# EAGLE design edison_mezzanine_9dof (EAGLE 6.6.0)

## Sheet 1 of 2
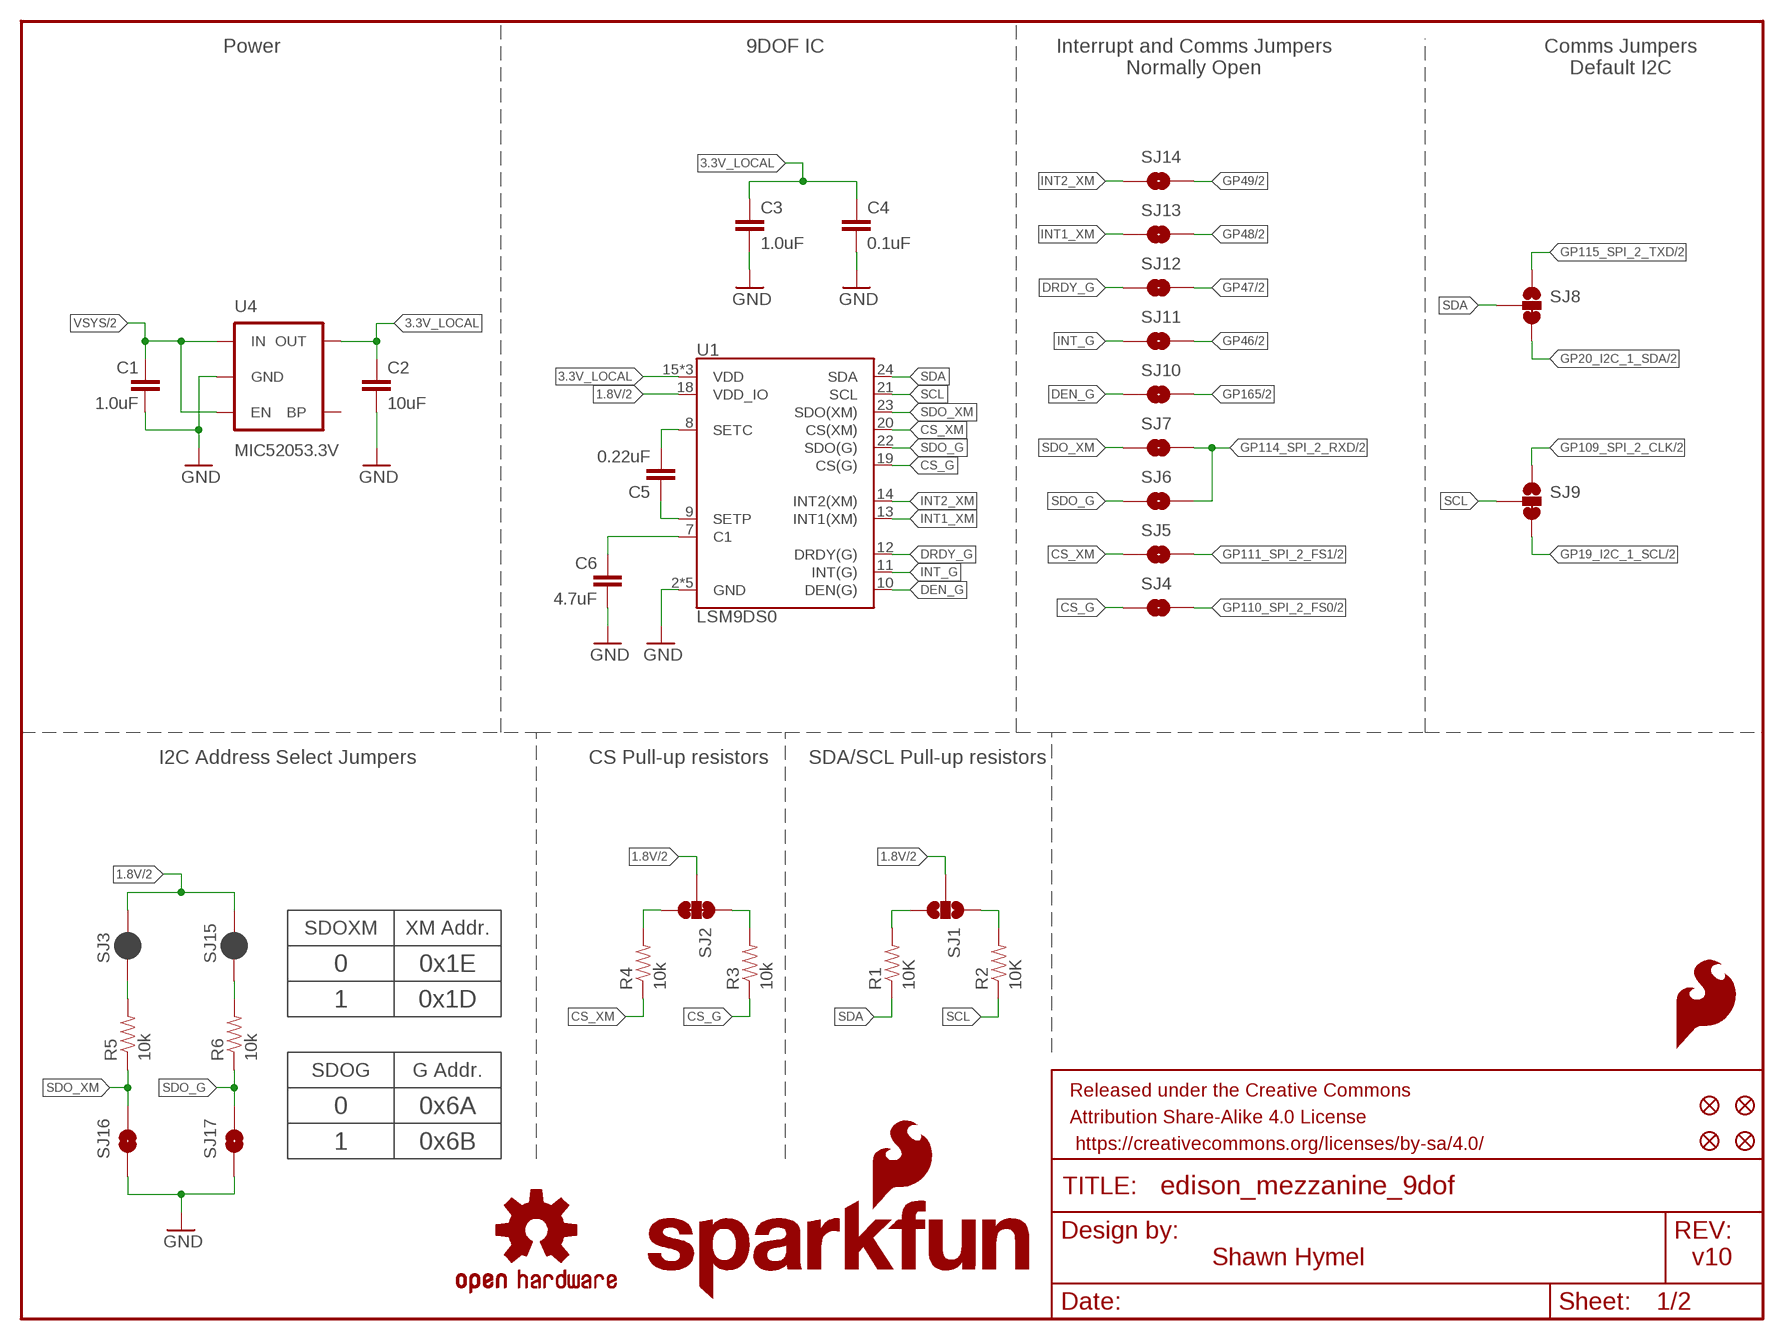
[diagram p0: schematic, sheet 1]

### Parts
C1  1.0uF  1.0UF-16V-10%(0603)  [0603-CAP]
C2  10uF  CAP0805  [0805]
C3  1.0uF  1.0UF-16V-10%(0603)  [0603-CAP]
C4  0.1uF  0.1UF-25V(+80/-20%)(0603)  [0603-CAP]
C5  0.22uF  0.22UF-25V-10%(0603)  [0603-CAP]
C6  4.7uF  4.7UF-6.3V-10%(0603)0603  [0603-CAP]
FID1  FIDUCIAL1X2  [FIDUCIAL-1X2]
FID2  FIDUCIAL1X2  [FIDUCIAL-1X2]
FID3  FIDUCIAL1X2  [FIDUCIAL-1X2]
FID4  FIDUCIAL1X2  [FIDUCIAL-1X2]
FRAME1  FRAME-LETTER  [CREATIVE_COMMONS]
LOGO1  SFE_LOGO_FLAME.2_INCH  [SFE_LOGO_FLAME_.2]
LOGO2  OSHW-LOGOS  [OSHW-LOGO-S]
LOGO3  SFE_LOGO_NAME_FLAME.1_INCH  [SFE_LOGO_NAME_FLAME_.1]
R1  10K  10KOHM1/10W1%(0603)0603  [0603-RES]
R2  10K  10KOHM1/10W1%(0603)0603  [0603-RES]
R3  10k  10K-1%RES-00824  [0603-RES]
R4  10k  10K-1%RES-00824  [0603-RES]
R5  10k  10K-1%RES-00824  [0603-RES]
R6  10k  10K-1%RES-00824  [0603-RES]
SJ1  JUMPER-PAD-3-NOYES_SILK  [PAD-JUMPER-3-NO_YES_SILK]
SJ2  JUMPER-PAD-3-NC_BY_TRACE  [PAD-JUMPER-3-3OF3_NC_BY_TRACE_YES_SILK_FULL_BOX]
SJ3  JUMPER-PAD-2-NC_BY_PASTE  [PAD-JUMPER-2-NC_BY_PASTE_YES_SILK]
SJ4  JUMPER-PAD-2-NOYES_SILK  [PAD-JUMPER-2-NO_YES_SILK]
SJ5  JUMPER-PAD-2-NOYES_SILK  [PAD-JUMPER-2-NO_YES_SILK]
SJ6  JUMPER-PAD-2-NOYES_SILK  [PAD-JUMPER-2-NO_YES_SILK]
SJ7  JUMPER-PAD-2-NOYES_SILK  [PAD-JUMPER-2-NO_YES_SILK]
SJ8  JUMPER-PAD-3-2OF3_NC_BY_TRACE_SMALL  [PAD-JUMPER-3-2OF3_NC_BY_TRACE_YES_SILK_FULL_BOX]
SJ9  JUMPER-PAD-3-2OF3_NC_BY_TRACE_SMALL  [PAD-JUMPER-3-2OF3_NC_BY_TRACE_YES_SILK_FULL_BOX]
SJ10  JUMPER-PAD-2-NOYES_SILK  [PAD-JUMPER-2-NO_YES_SILK]
SJ11  JUMPER-PAD-2-NOYES_SILK  [PAD-JUMPER-2-NO_YES_SILK]
SJ12  JUMPER-PAD-2-NOYES_SILK  [PAD-JUMPER-2-NO_YES_SILK]
SJ13  JUMPER-PAD-2-NOYES_SILK  [PAD-JUMPER-2-NO_YES_SILK]
SJ14  JUMPER-PAD-2-NOYES_SILK  [PAD-JUMPER-2-NO_YES_SILK]
SJ15  JUMPER-PAD-2-NC_BY_PASTE  [PAD-JUMPER-2-NC_BY_PASTE_YES_SILK]
SJ16  JUMPER-PAD-2-NOYES_SILK  [PAD-JUMPER-2-NO_YES_SILK]
SJ17  JUMPER-PAD-2-NOYES_SILK  [PAD-JUMPER-2-NO_YES_SILK]
U1  LSM9DS0  [LGA-24]
U4  MIC52053.3V  [SOT23-5]

### Nets
1.8V: SJ1.2 SJ2.2 SJ3.2 SJ15.2 U1.18(VDD_IO) ; also sheet 2
3.3V_LOCAL: C2.1 C3.1 C4.1 U1.15(VDD) U1.16(VDD) U1.17(VDD) U4.5(OUT)
CS_G: R3.1 SJ4.1 U1.19(CS(G))
CS_XM: R4.1 SJ5.1 U1.20(CS(XM))
DEN_G: SJ10.1 U1.10(DEN(G))
DRDY_G: SJ12.1 U1.12(DRDY(G))
GND: C1.2 C2.2 C3.2 C4.2 C6.2 SJ16.1 SJ17.1 U1.2(GND) U1.3(GND) U1.4(GND) U1.5(GND) U1.6(GND) U4.2(GND) ; also sheet 2
GP19_I2C_1_SCL: SJ9.3 ; also sheet 2
GP20_I2C_1_SDA: SJ8.3 ; also sheet 2
GP46: SJ11.2 ; also sheet 2
GP47: SJ12.2 ; also sheet 2
GP48: SJ13.2 ; also sheet 2
GP49: SJ14.2 ; also sheet 2
GP109_SPI_2_CLK: SJ9.1 ; also sheet 2
GP110_SPI_2_FS0: SJ4.2 ; also sheet 2
GP111_SPI_2_FS1: SJ5.2 ; also sheet 2
GP114_SPI_2_RXD: SJ6.2 SJ7.2 ; also sheet 2
GP115_SPI_2_TXD: SJ8.1 ; also sheet 2
GP165: SJ10.2 ; also sheet 2
INT1_XM: SJ13.1 U1.13(INT1(XM))
INT2_XM: SJ14.1 U1.14(INT2(XM))
INT_G: SJ11.1 U1.11(INT(G))
N$1: C5.1 U1.9(SETP)
N$2: C5.2 U1.8(SETC)
N$3: C6.1 U1.7(C1)
N$4: R3.2 SJ2.1
N$5: R4.2 SJ2.3
N$6: R1.2 SJ1.3
N$7: R2.2 SJ1.1
N$12: R5.2 SJ3.1
N$13: R6.2 SJ15.1
SCL: R2.1 SJ9.2 U1.21(SCL)
SDA: R1.1 SJ8.2 U1.24(SDA)
SDO_G: R6.1 SJ6.1 SJ17.2 U1.22(SDO(G))
SDO_XM: R5.1 SJ7.1 SJ16.2 U1.23(SDO(XM))
VSYS: C1.1 U4.1(IN) U4.3(EN) ; also sheet 2
Unconnected: U4.4(BP)

### Notes on the sheet
- Power | 9DOF IC
- Interrupt and Comms Jumpers
  Normally Open
- Comms Jumpers
  Default I2C
- I2C Address Select Jumpers | CS Pull-up resistors | SDA/SCL Pull-up resistors
- SDOXM | XM Addr.
- 0 | 0x1E
- 1 | 0x1D
- SDOG | G Addr.
- 0 | 0x6A
- 1 | 0x6B
- Shawn Hymel | v10

## Sheet 2 of 2
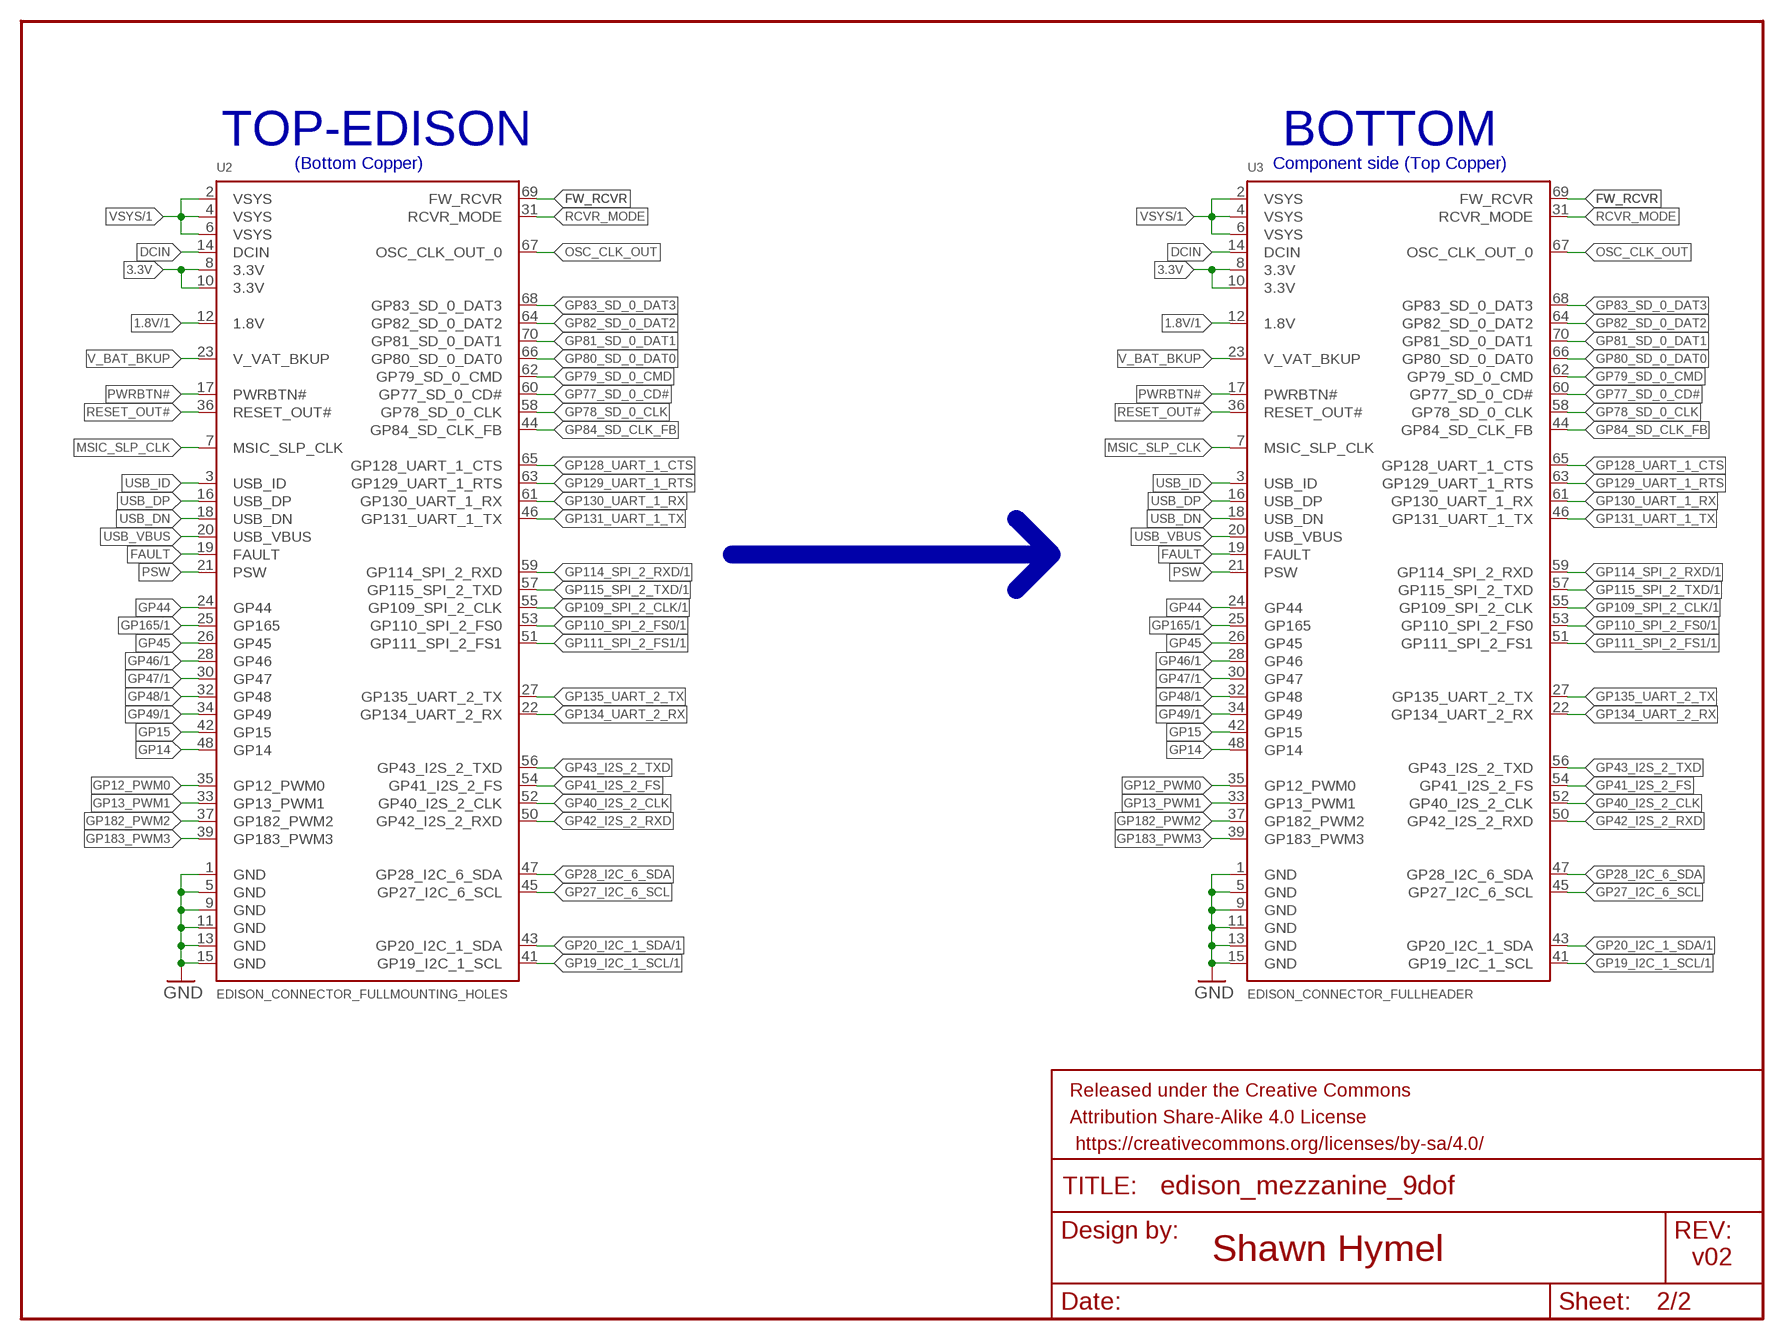
[diagram p1: schematic, sheet 2]

### Parts
FRAME2  FRAME-LETTER  [CREATIVE_COMMONS]
U2  EDISON_CONNECTOR_FULLMOUNTING_HOLES  [EDISON_DAUGHTER]
U3  EDISON_CONNECTOR_FULLHEADER  [DF40C-70DP-0.4(51)]

### Nets
1.8V: U2.12(1.8V) U3.12(1.8V) ; also sheet 1
3.3V: U2.8(3.3V) U2.10(3.3V) U3.8(3.3V) U3.10(3.3V)
DCIN: U2.14(DCIN) U3.14(DCIN)
FAULT: U2.19(FAULT) U3.19(FAULT)
FW_RCVR: U2.69(FW_RCVR) U3.69(FW_RCVR)
GND: U2.1(GND) U2.5(GND) U2.9(GND) U2.11(GND) U2.13(GND) U2.15(GND) U3.1(GND) U3.5(GND) U3.9(GND) U3.11(GND) U3.13(GND) U3.15(GND) ; also sheet 1
GP12_PWM0: U2.35(GP12_PWM0) U3.35(GP12_PWM0)
GP13_PWM1: U2.33(GP13_PWM1) U3.33(GP13_PWM1)
GP14: U2.48(GP14) U3.48(GP14)
GP15: U2.42(GP15) U3.42(GP15)
GP19_I2C_1_SCL: U2.41(GP19_I2C_1_SCL) U3.41(GP19_I2C_1_SCL) ; also sheet 1
GP20_I2C_1_SDA: U2.43(GP20_I2C_1_SDA) U3.43(GP20_I2C_1_SDA) ; also sheet 1
GP27_I2C_6_SCL: U2.45(GP27_I2C_6_SCL) U3.45(GP27_I2C_6_SCL)
GP28_I2C_6_SDA: U2.47(GP28_I2C_6_SDA) U3.47(GP28_I2C_6_SDA)
GP40_I2S_2_CLK: U2.52(GP40_I2S_2_CLK) U3.52(GP40_I2S_2_CLK)
GP41_I2S_2_FS: U2.54(GP41_I2S_2_FS) U3.54(GP41_I2S_2_FS)
GP42_I2S_2_RXD: U2.50(GP42_I2S_2_RXD) U3.50(GP42_I2S_2_RXD)
GP43_I2S_2_TXD: U2.56(GP43_I2S_2_TXD) U3.56(GP43_I2S_2_TXD)
GP44: U2.24(GP44) U3.24(GP44)
GP45: U2.26(GP45) U3.26(GP45)
GP46: U2.28(GP46) U3.28(GP46) ; also sheet 1
GP47: U2.30(GP47) U3.30(GP47) ; also sheet 1
GP48: U2.32(GP48) U3.32(GP48) ; also sheet 1
GP49: U2.34(GP49) U3.34(GP49) ; also sheet 1
GP77_SD_0_CD#: U2.60(GP77_SD_0_CD#) U3.60(GP77_SD_0_CD#)
GP78_SD_0_CLK: U2.58(GP78_SD_0_CLK) U3.58(GP78_SD_0_CLK)
GP79_SD_0_CMD: U2.62(GP79_SD_0_CMD) U3.62(GP79_SD_0_CMD)
GP80_SD_0_DAT0: U2.66(GP80_SD_0_DAT0) U3.66(GP80_SD_0_DAT0)
GP81_SD_0_DAT1: U2.70(GP81_SD_0_DAT1) U3.70(GP81_SD_0_DAT1)
GP82_SD_0_DAT2: U2.64(GP82_SD_0_DAT2) U3.64(GP82_SD_0_DAT2)
GP83_SD_0_DAT3: U2.68(GP83_SD_0_DAT3) U3.68(GP83_SD_0_DAT3)
GP84_SD_CLK_FB: U2.44(GP84_SD_CLK_FB) U3.44(GP84_SD_CLK_FB)
GP109_SPI_2_CLK: U2.55(GP109_SPI_2_CLK) U3.55(GP109_SPI_2_CLK) ; also sheet 1
GP110_SPI_2_FS0: U2.53(GP110_SPI_2_FS0) U3.53(GP110_SPI_2_FS0) ; also sheet 1
GP111_SPI_2_FS1: U2.51(GP111_SPI_2_FS1) U3.51(GP111_SPI_2_FS1) ; also sheet 1
GP114_SPI_2_RXD: U2.59(GP114_SPI_2_RXD) U3.59(GP114_SPI_2_RXD) ; also sheet 1
GP115_SPI_2_TXD: U2.57(GP115_SPI_2_TXD) U3.57(GP115_SPI_2_TXD) ; also sheet 1
GP128_UART_1_CTS: U2.65(GP128_UART_1_CTS) U3.65(GP128_UART_1_CTS)
GP129_UART_1_RTS: U2.63(GP129_UART_1_RTS) U3.63(GP129_UART_1_RTS)
GP130_UART_1_RX: U2.61(GP130_UART_1_RX) U3.61(GP130_UART_1_RX)
GP131_UART_1_TX: U2.46(GP131_UART_1_TX) U3.46(GP131_UART_1_TX)
GP134_UART_2_RX: U2.22(GP134_UART_2_RX) U3.22(GP134_UART_2_RX)
GP135_UART_2_TX: U2.27(GP135_UART_2_TX) U3.27(GP135_UART_2_TX)
GP165: U2.25(GP165) U3.25(GP165) ; also sheet 1
GP182_PWM2: U2.37(GP182_PWM2) U3.37(GP182_PWM2)
GP183_PWM3: U2.39(GP183_PWM3) U3.39(GP183_PWM3)
MSIC_SLP_CLK: U2.7(MSIC_SLP_CLK) U3.7(MSIC_SLP_CLK)
OSC_CLK_OUT: U2.67(OSC_CLK_OUT_0) U3.67(OSC_CLK_OUT_0)
PSW: U2.21(PSW) U3.21(PSW)
PWRBTN#: U2.17(PWRBTN#) U3.17(PWRBTN#)
RCVR_MODE: U2.31(RCVR_MODE) U3.31(RCVR_MODE)
RESET_OUT#: U2.36(RESET_OUT#) U3.36(RESET_OUT#)
USB_DN: U2.18(USB_DN) U3.18(USB_DN)
USB_DP: U2.16(USB_DP) U3.16(USB_DP)
USB_ID: U2.3(USB_ID) U3.3(USB_ID)
USB_VBUS: U2.20(USB_VBUS) U3.20(USB_VBUS)
V_BAT_BKUP: U2.23(V_VAT_BKUP) U3.23(V_VAT_BKUP)
VSYS: U2.2(VSYS) U2.4(VSYS) U2.6(VSYS) U3.2(VSYS) U3.4(VSYS) U3.6(VSYS) ; also sheet 1

### Buses
B$1

### Notes on the sheet
- TOP-EDISON | BOTTOM
- (Bottom Copper) | Component side (Top Copper)
- Shawn Hymel
- v02

## Library data of the parts
C1 C3 = SparkFun-Capacitors:1.0UF-16V-10%(0603): CAP-00868; PROD_ID: CAP-00868
C2 = SparkFun-Capacitors:CAP: Capacitor Standard 0603 ceramic capacitor, and 0.1" leaded capacitor.; PROD_ID: CAP-11330
C4 = SparkFun-Capacitors:0.1UF-25V(+80/-20%)(0603): CAP-00810 Ceramic Standard decoupling cap; PROD_ID: CAP-00810
C5 = SparkFun-Capacitors:0.22UF-25V-10%(0603): CAP-07822; PROD_ID: CAP-07822
C6 = SparkFun-Capacitors:4.7UF-6.3V-10%(0603): CAP-08280; PROD_ID: CAP-08280
FID1-FID4 = SparkFun-Aesthetics:FIDUCIAL: Fiducial Alignment Points Various fiducial points for machine vision alignment.
FRAME1 FRAME2 = SparkFun-Aesthetics:FRAME-LETTER: Schematic Frame Standard 8.5x11 US Letter frame
LOGO1 = SparkFun-Aesthetics:SFE_LOGO_FLAME: SFE Logo, flame only This is the SparkFun flame logo. The logo on the schematic will always be the same size; the package variant is the height of the flame. Default layer for the logo on the board is tSilk.
LOGO2 = SparkFun-Aesthetics:OSHW-LOGO: Open Source Hardware Logo This logo indicates the piece of hardware it is found on incorporates a OSHW license and/or adheres to the definition of open source hardware found here: http://freedomdefined.org/OSHW
LOGO3 = SparkFun-Aesthetics:SFE_LOGO_NAME_FLAME: SFE Logo, name and flame This is the SparkFun full logo. The logo on the schematic will always be the same size; the package variant is the height of the flame part of the logo. Default layer for the logo on the board is tSilk.
R1 R2 = SparkFun-Resistors:10KOHM1/10W1%(0603): RES-00824; PROD_ID: RES-00824
R3-R6 = SparkFun-Resistors:10K-1%: 10k-ohm SMT 1/10W - 1% (0603) RES-00824; PROD_ID: RES-00824
SJ1 = SparkFun-Passives:JUMPER-PAD-3-NO
SJ2 = SparkFun-Passives:JUMPER-PAD-3-NC_BY_TRACE
SJ3 SJ15 = SparkFun-Passives:JUMPER-PAD-2-NC_BY_PASTE
SJ4-SJ7 SJ10-SJ14 SJ16 SJ17 = SparkFun-Passives:JUMPER-PAD-2-NO
SJ8 SJ9 = SparkFun-Passives:JUMPER-PAD-3-2OF3_NC_BY_TRACE
U1 = SparkFun-DigitalIC:LSM9DS0: LSM9DS0 3D Accelerometer, 3D Gyroscope, 3D Magnetomter Features: 3 acceleration channels, 3 angular rate channels, 3 magnetic field channels ±2/±4/±6/±8/±16 g linear acceleration full scale ±2/±4/±8/±12 gauss magnetic full scale ±245/±500/±2000 dps angular rate full scale 16-bit data output SPI / I2C serial interfaces Analog supply voltage 2.4 V to 3.6 V Power-down mode / low-power mode Programmable interrupt generators Embedded self-test Embedded temperature sensor Embedded FIFO Position and motion detection functions Click/double-click recognition
U2 U3 = Edison:EDISON_CONNECTOR_FULL
U4 = SparkFun-PowerIC:MIC5205: MIC5205 150mA vreg 3.3V - VREG-00822 5V - VREG-00823; PROD_ID: VREG-00822

## Board
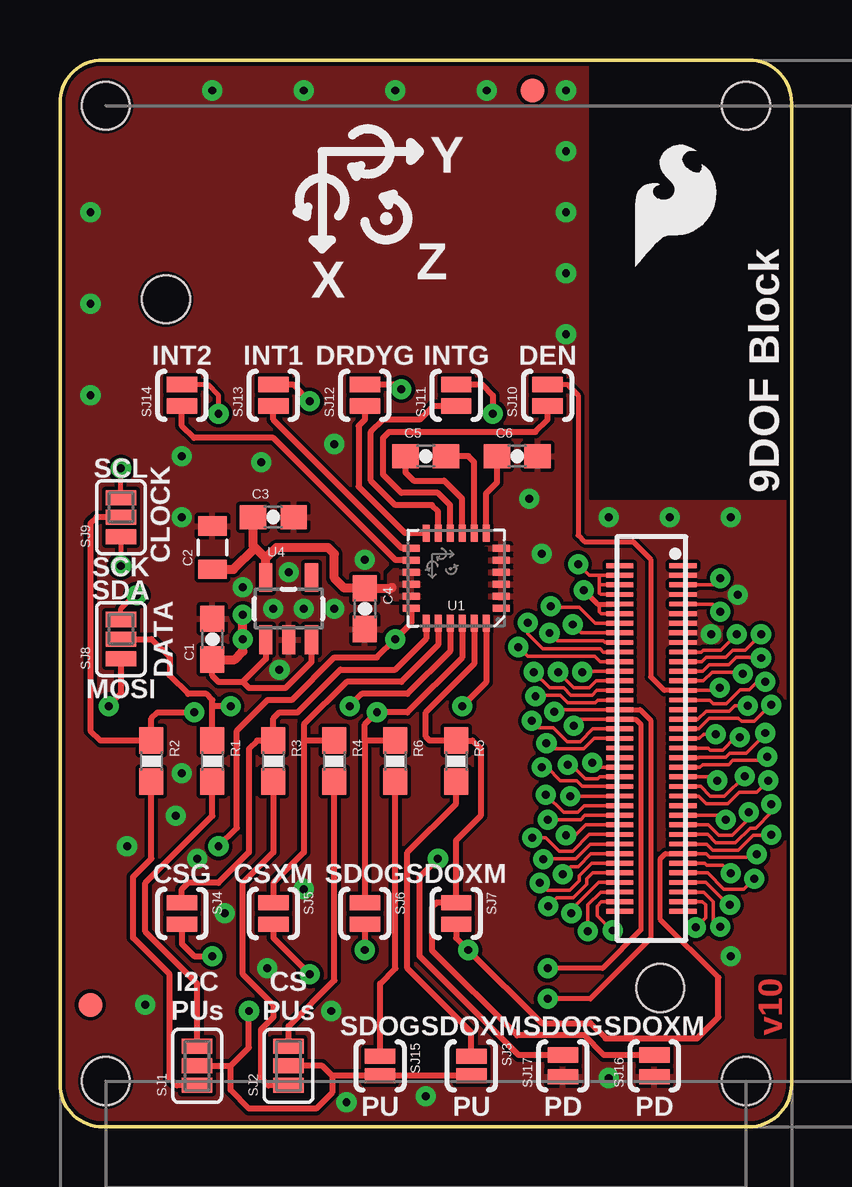
[diagram p2: board, top side]
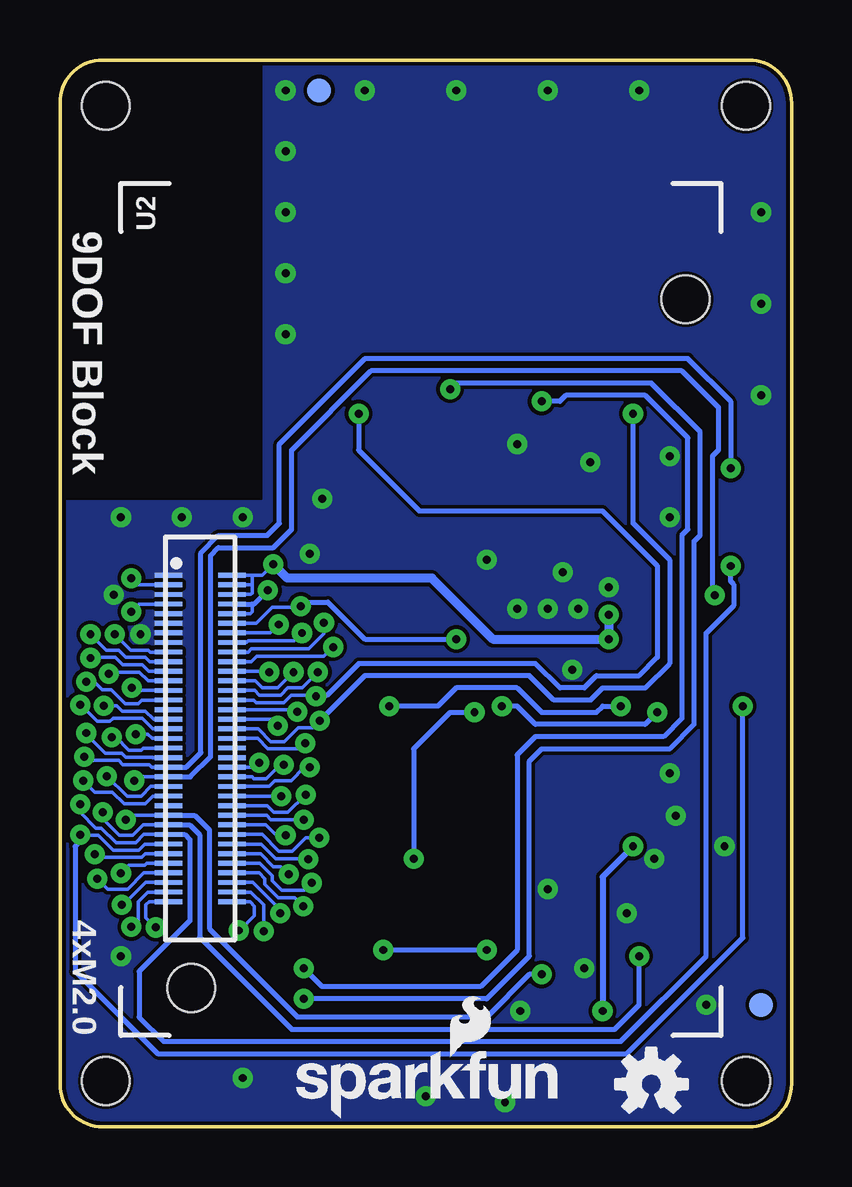
[diagram p3: board, bottom side, seen from below]

Size 30.48 x 44.45 mm. Coordinates in mm from the lower left corner, seen from the top.
Outline: 30.48,42.67 30.48,1.78 arc-90 28.7,0 1.78,0 arc-90 0,1.78 0,42.67 arc-90 1.78,44.45 28.7,44.45 arc-90 30.48,42.67
Copper layers (1*16): Top 0.035mm / dielectric 1.5mm / Bottom 0.035mm
Design rules "SparkFun-2-layer *": minimum track width 6mil, minimum drill 13mil, track to track 6mil, track to pad 6mil, pad to pad 6mil, via to via 6mil, smd to smd 6mil, copper to edge 6mil, drill to drill 6mil, minimum pad ring 12mil, minimum via ring 10mil, stop-mask expansion 4mil, vias tented up to drill 20mil, thermal gap 6mil
Holes 2 mm at 28.57,1.91 1.91,1.91 1.91,42.55 28.57,42.55
tRestrict: area 22.1,26.2 to 30.5,44.5; area 15.2,21.6 to 17.8,24.1
bRestrict: area 22.1,26.2 to 30.5,44.5

### Footprints (pad centres in the part's own frame; a part is rotated, then mirrored left to right if it is on the bottom)
0603-CAP = smd 1.1 x 1: 1 -0.85,0; 2 0.85,0
0805 = smd 0.8 x 1.2: 1 -0.9,0; 2 0.9,0
FIDUCIAL-1X2 = smd 1 x 1: 1 0,0
0603-RES = smd 1.1 x 1: 1 -0.85,0; 2 0.85,0
PAD-JUMPER-3-NC_BY_PASTE_YES_SILK_FULL_BOX = smd 0.635 x 1.27: 1 -0.813,0; 2 0,0; 3 0.813,0
PAD-JUMPER-2-NC_BY_PASTE_YES_SILK = smd 0.635 x 1.27: 1 -0.401,0; 2 0.413,0
PAD-JUMPER-2-NO_YES_SILK = smd 0.635 x 1.27: 1 -0.45,0; 2 0.45,0
PAD-JUMPER-3-2OF3_NC_BY_PASTE_YES_SILK_FULL_BOX = smd 0.635 x 1.27: 1 -0.813,0; 2 0,0; 3 0.813,0
LGA-24 = smd 0.7 x 0.29: 1 -1.875,1.25; 2 -1.875,0.75; 3 -1.875,0.25; 4 -1.875,-0.25; 5 -1.875,-0.75; 6 -1.875,-1.25; 13 1.875,-1.25; 14 1.875,-0.75; 15 1.875,-0.25; 16 1.875,0.25; 17 1.875,0.75; 18 1.875,1.25 | smd 0.29 x 0.7: 7 -1.25,-1.875; 8 -0.75,-1.875; 9 -0.25,-1.875; 10 0.25,-1.875; 11 0.75,-1.875; 12 1.25,-1.875; 19 1.25,1.875; 20 0.75,1.875; 21 0.25,1.875; 22 -0.25,1.875; 23 -0.75,1.875; 24 -1.25,1.875
EDISON_DAUGHTER = smd 1.14 x 0.2: 1 1.98,19.17; 2 4.62,19.17; 3 1.98,18.77; 4 4.62,18.77; 5 1.98,18.37; 6 4.62,18.37; 7 1.98,17.97; 8 4.62,17.97; 9 1.98,17.57; 10 4.62,17.57; 11 1.98,17.17; 12 4.62,17.17; 13 1.98,16.77; 14 4.62,16.77; 15 1.98,16.37; 16 4.62,16.37; 17 1.98,15.97; 18 4.62,15.97; 19 1.98,15.57; 20 4.62,15.57; 21 1.98,15.17; 22 4.62,15.17; 23 1.98,14.77; 24 4.62,14.77; 25 1.98,14.37; 26 4.62,14.37; 27 1.98,13.97; 28 4.62,13.97; 29 1.98,13.57; 30 4.62,13.57; 31 1.98,13.17; 32 4.62,13.17; 33 1.98,12.77; 34 4.62,12.77; 35 1.98,12.37; 36 4.62,12.37; 37 1.98,11.97; 38 4.62,11.97; 39 1.98,11.57; 40 4.62,11.57; 41 1.98,11.17; 42 4.62,11.17; 43 1.98,10.77; 44 4.62,10.77; 45 1.98,10.37; 46 4.62,10.37; 47 1.98,9.97; 48 4.62,9.97; 49 1.98,9.57; 50 4.62,9.57; 51 1.98,9.17; 52 4.62,9.17; 53 1.98,8.77; 54 4.62,8.77; 55 1.98,8.37; 56 4.62,8.37; 57 1.98,7.97; 58 4.62,7.97; 59 1.98,7.57; 60 4.62,7.57; 61 1.98,7.17; 62 4.62,7.17; 63 1.98,6.77; 64 4.62,6.77; 65 1.98,6.37; 66 4.62,6.37; 67 1.98,5.97; 68 4.62,5.97; 69 1.98,5.57; 70 4.62,5.57 | hole 2: 23.53,30.67; 2.93,1.98
DF40C-70DP-0.4(51) = smd 0.2 x 1.14 bottom: 1 6.8,1.32; 2 6.8,-1.32; 3 6.4,1.32; 4 6.4,-1.32; 5 6,1.32; 6 6,-1.32; 7 5.6,1.32; 8 5.6,-1.32; 9 5.2,1.32; 10 5.2,-1.32; 11 4.8,1.32; 12 4.8,-1.32; 13 4.4,1.32; 14 4.4,-1.32; 15 4,1.32; 16 4,-1.32; 17 3.6,1.32; 18 3.6,-1.32; 19 3.2,1.32; 20 3.2,-1.32; 21 2.8,1.32; 22 2.8,-1.32; 23 2.4,1.32; 24 2.4,-1.32; 25 2,1.32; 26 2,-1.32; 27 1.6,1.32; 28 1.6,-1.32; 29 1.2,1.32; 30 1.2,-1.32; 31 0.8,1.32; 32 0.8,-1.32; 33 0.4,1.32; 34 0.4,-1.32; 35 0,1.32; 36 0,-1.32; 37 -0.4,1.32; 38 -0.4,-1.32; 39 -0.8,1.32; 40 -0.8,-1.32; 41 -1.2,1.32; 42 -1.2,-1.32; 43 -1.6,1.32; 44 -1.6,-1.32; 45 -2,1.32; 46 -2,-1.32; 47 -2.4,1.32; 48 -2.4,-1.32; 49 -2.8,1.32; 50 -2.8,-1.32; 51 -3.2,1.32; 52 -3.2,-1.32; 53 -3.6,1.32; 54 -3.6,-1.32; 55 -4,1.32; 56 -4,-1.32; 57 -4.4,1.32; 58 -4.4,-1.32; 59 -4.8,1.32; 60 -4.8,-1.32; 61 -5.2,1.32; 62 -5.2,-1.32; 63 -5.6,1.32; 64 -5.6,-1.32; 65 -6,1.32; 66 -6,-1.32; 67 -6.4,1.32; 68 -6.4,-1.32; 69 -6.8,1.32; 70 -6.8,-1.32; NC1 7.2,1.32; NC2 7.2,-1.32; NC3 -7.2,-1.32; NC4 -7.2,1.32
SOT23-5 = smd 0.55 x 1.2: 1 -0.95,-1.3; 2 0,-1.3; 3 0.95,-1.3; 4 0.95,1.3; 5 -0.95,1.3

### Placement (x,y rotation side)
C1  6.35,20.32 90 top
C2  6.35,24.13 90 top
C3  8.89,25.4 0 top
C4  12.7,21.59 270 top
C5  15.24,27.94 0 top
C6  19.05,27.94 0 top
FID1  1.27,5.08 0 top
FID2  19.68,43.18 0 top
FID3  19.68,43.18 0 bottom
FID4  1.27,5.08 0 bottom
FRAME1  0,-15.24 0 top  (outside the outline)
FRAME2  0,-15.24 0 top  (outside the outline)
LOGO1  23.62,35.56 0 top
LOGO2  5.84,1.78 0 bottom
LOGO3  21.08,0.25 0 bottom
R1  DNP  [0603-RES]  6.35,15.24 270 top
R2  DNP  [0603-RES]  3.81,15.24 270 top
R3  8.89,15.24 270 top
R4  11.43,15.24 270 top
R5  16.51,15.24 270 top
R6  13.97,15.24 270 top
SJ1  JUMPER-PAD-3-NC_BY_PASTE  [PAD-JUMPER-3-NC_BY_PASTE_YES_SILK_FULL_BOX]  5.71,2.54 90 top
SJ2  JUMPER-PAD-3-NC_BY_PASTE  [PAD-JUMPER-3-NC_BY_PASTE_YES_SILK_FULL_BOX]  9.53,2.54 90 top
SJ3  17.14,2.54 270 top
SJ4  5.08,8.89 270 top
SJ5  8.89,8.89 270 top
SJ6  12.7,8.89 270 top
SJ7  16.51,8.89 270 top
SJ8  JUMPER-PAD-3-2OF3_NC_BY_PASTE  [PAD-JUMPER-3-2OF3_NC_BY_PASTE_YES_SILK_FULL_BOX]  2.54,20.32 90 top
SJ9  JUMPER-PAD-3-2OF3_NC_BY_PASTE  [PAD-JUMPER-3-2OF3_NC_BY_PASTE_YES_SILK_FULL_BOX]  2.54,25.4 90 top
SJ10  20.32,30.48 90 top
SJ11  16.51,30.48 90 top
SJ12  12.7,30.48 90 top
SJ13  8.89,30.48 90 top
SJ14  5.08,30.48 90 top
SJ15  13.34,2.54 270 top
SJ16  24.77,2.54 90 top
SJ17  20.95,2.54 90 top
U1  16.51,22.86 180 top
U2  27.94,3.81 0 bottom
U3  24.64,16.18 90 bottom
U4  9.53,21.59 0 top

### Tracks (layer width: path | path; a pad name or v marks a point on that pad's centre or on a via)
1.8V  (via drill 0.33)
  Top 0.152: U3.12 22.3,20.98 21.64,21.64 20.5,21.64 v20.45,21.69
  Top 0.254: v6.6,11.68 7.37,12.45 7.37,16.51 8.64,17.78 9.65,17.78 11.43,19.56 13.21,19.56 v13.97,20.32 14.63,20.98 U1.18 | SJ1.2 7.11,2.54 | 7.11,2.54 7.87,3.3 v7.87,4.83 | SJ3.2 SJ15.2 11.34,2.13 | SJ2.2 10.92,2.54 11.34,2.13 | 11.34,2.13 11.34,1.43 10.67,0.76 7.87,0.76 7.11,1.52 7.11,2.54
  Bottom 0.152: v20.45,21.69 20.5,21.64 21.64,21.64 22.3,20.98 U3.12
  Bottom 0.203: v13.97,20.32 17.78,20.32 19.32,21.86 20.28,21.86 v20.45,21.69
  Bottom 0.254: v6.6,11.68 7.87,10.41 v7.87,4.83
3.3V  (via drill 0.33)
  Top 0.152: 22.34,21.83 22.48,21.69 22.48,21.46 22.56,21.38 U3.10
  Top 0.203: v21.82,22.35 22.34,21.83 22.39,21.78 U3.8
  Bottom 0.152: U3.10 22.56,21.38 22.48,21.46 22.48,21.78 | U3.8
  Bottom 0.203: U3.8 22.48,21.78 22.39,21.78 v21.82,22.35
3.3V_LOCAL
  Top 0.381: U4.5 8.57,23.68 | 8.57,23.68 8.13,24.13 | 8.13,24.13 8.04,24.22 C3.1 | C2.1 7.23,23.23 8.13,24.13 | 13.84,22.48 13.8,22.44 C4.1 11.85,22.44 11.43,22.86 11.43,23.88 11.18,24.13 9.02,24.13 8.57,23.68
  pour Top (isolate 0.203, rank 2): 14.99,23.24 13.97,23.24 13.72,22.99 13.72,22.23 13.97,21.97 14.99,21.97
CS_G
  Top 0.254: SJ4.1 5.08,9.91 5.33,10.16 6.6,10.16 7.87,11.43 7.87,15.75 8.22,16.09 R3.1 8.89,17.02 9.14,17.27 9.91,17.27 11.68,19.05 13.97,19.05 15.26,20.34 U1.19
CS_XM
  Top 0.254: 10.16,16 10.16,16.76 11.94,18.54 14.22,18.54 15.76,20.08 U1.20 | 10.16,16 10.16,11.43 8.89,10.16 SJ5.1 | R4.1 10.25,16.09 10.16,16
DCIN  (via drill 0.33)
  Top 0.152: v21.36,20.93 21.71,20.58 U2.14
  Bottom 0.152: U2.14 21.71,20.58 v21.36,20.93
DEN_G
  Top 0.254: U1.10 16.26,25.9 15.75,26.42 14.22,26.42 13.46,27.18 13.46,28.7 13.72,28.96 19.81,28.96 20.32,29.46 SJ10.1
DRDY_G
  Top 0.254: U1.12 14.38,24.73 12.45,26.67 12.45,29.21 12.7,29.46 SJ12.1
FAULT  (via drill 0.33)
  Top 0.152: U3.19 26.75,19.38 26.92,19.56 27.74,19.56 28.04,19.86 28.55,19.86 v29.21,20.52
  Bottom 0.152: v29.21,20.52 28.55,19.86 28.04,19.86 27.74,19.56 26.92,19.56 26.75,19.38 U3.19
FW_RCVR  (via drill 0.33)
  Top 0.152: v26.49,8.31 26.9,8.71 26.9,9.25 26.76,9.38 U3.69
  Bottom 0.152: U3.69 26.76,9.38 26.9,9.25 26.9,8.71 v26.49,8.31
GND  (via drill 0.33)
  other vias: 27.13,20.52 28.24,22.17 5.08,25.4 21.08,33.02 27.94,25.4 2.79,11.68 4.83,12.95 27.94,7.11 21.08,35.56 21.08,38.1 21.08,40.64 21.08,43.18 25.4,25.4 17.78,43.18 13.97,43.18 10.16,43.18 6.35,43.18 1.27,38.1 1.27,34.29 1.27,30.48 6.86,8.89 5.71,11.18 10.16,9.91 22.86,25.4 19.56,26.16 8.89,21.59 10.16,21.59 9.14,19.05 22.86,2.03 15.24,1.27 11.94,1.02 11.43,21.59 7.62,22.48 9.53,23.11 12.7,23.62 8.38,27.69 11.43,28.45 5.08,27.94 3.56,5.08 8.64,6.6 11.3,4.83 5.08,14.73 20.07,23.88
  pour Bottom (isolate 0.051, rank 6): 30.48,42.67 30.48,1.78 arc-90 28.7,0 1.78,0 arc-90 0,1.78 0,42.67 arc-90 1.78,44.45 28.7,44.45 arc-90
  pour Top (isolate 0.051, rank 6): 30.48,1.73 arc-90 28.75,0 1.78,0 arc-90 0,1.78 0,42.67 arc-90 1.78,44.45 28.7,44.45 arc-90 30.48,42.67
GP12_PWM0  (via drill 0.33)
  Top 0.152: U3.35 26.64,16.18 26.82,16.36 v27.33,16.36
  Bottom 0.152: v27.33,16.36 26.82,16.36 26.64,16.18 U3.35 | U3.35
GP13_PWM1  (via drill 0.33)
  Top 0.152: v29.64,17.58 29.62,17.58 28.93,16.89 28.4,16.89 28.27,17.02 27.05,17.02 26.61,16.58 U3.33
  Bottom 0.152: U3.33 26.61,16.58 27.05,17.02 28.27,17.02 28.4,16.89 28.93,16.89 29.62,17.58 v29.64,17.58
GP14  (via drill 0.33)
  Top 0.152: v21.26,13.77 21.27,13.78 U3.48
  Bottom 0.152: U3.48 21.27,13.78 v21.26,13.77
GP15  (via drill 0.33)
  Top 0.152: U3.42 22.36,14.98 v22.17,15.16
  Bottom 0.152: v22.17,15.16 22.36,14.98 U3.42
GP19_I2C_1_SCL  (via drill 0.33)
  Top 0.152: U3.41 26.66,14.98 26.77,15.09 27.86,15.09 28.04,15.27 29.31,15.27 v29.46,15.42
  Top 0.203: SJ9.3 v2.54,27.43
  Bottom 0.152: v29.46,15.42 29.31,15.27 28.04,15.27 27.86,15.09 26.77,15.09 26.66,14.98 U3.41
  Bottom 0.203: U3.41 25.23,14.98 24.61,15.6 24.61,23.9 23.88,24.64 21.84,24.64 21.34,25.15 21.34,28.45 17.78,32 4.32,32 2.54,30.23 v2.54,27.43
GP20_I2C_1_SDA  (via drill 0.33)
  Top 0.152: U3.43 27.23,14.58 v27.38,14.43
  Top 0.203: SJ8.3 2.54,21.59 3.1,22.15 v3.2,22.15
  Bottom 0.152: v27.38,14.43 27.23,14.58 U3.43 | U3.43
  Bottom 0.203: U3.43 25.04,14.58 24.21,15.42 24.21,23.8 23.88,24.13 21.59,24.13 20.83,24.89 20.83,28.19 17.53,31.5 4.57,31.5 3.05,29.97 3.05,28.19 3.3,27.94 3.3,22.25 v3.2,22.15
GP27_I2C_6_SCL  (via drill 0.33)
  Top 0.152: v28.52,14.61 27.69,13.77 27.1,13.77 26.69,14.18 U3.45
  Bottom 0.152: U3.45 26.69,14.18 27.1,13.77 27.69,13.77 v28.52,14.61
GP28_I2C_6_SDA  (via drill 0.33)
  Top 0.152: U3.47 26.61,13.78 26.92,13.46 27.81,13.46 28.3,13.95 29.03,13.95 v29.52,14.43
  Bottom 0.152: v29.52,14.43 29.03,13.95 28.3,13.95 27.81,13.46 26.92,13.46 26.61,13.78 U3.47
GP40_I2S_2_CLK  (via drill 0.33)
  Top 0.152: U3.52 21.87,12.98 21.69,12.8 v20.32,12.8
  Bottom 0.152: v20.32,12.8 21.69,12.8 21.87,12.98 U3.52
GP41_I2S_2_FS  (via drill 0.33)
  Top 0.152: v21.08,12.14 21.46,12.14 21.9,12.58 U3.54
  Bottom 0.152: U3.54 21.9,12.58 21.46,12.14 v21.08,12.14
GP42_I2S_2_RXD  (via drill 0.33)
  Top 0.152: U3.50 21.84,13.38 21.57,13.11 20.98,13.11 v20.24,13.84
  Bottom 0.152: v20.24,13.84 20.98,13.11 21.57,13.11 21.84,13.38 U3.50
GP43_I2S_2_TXD  (via drill 0.33)
  Top 0.152: U3.56 22.06,12.18 21.36,11.48 20.8,11.48 20.24,12.04 v19.68,12.04
  Bottom 0.152: v19.68,12.04 20.24,12.04 20.8,11.48 21.36,11.48 22.06,12.18 U3.56
GP44  (via drill 0.33)
  Top 0.152: v20.75,18.95 21.41,18.29 22.05,18.29 22.34,18.58 U3.24
  Bottom 0.152: v20.75,18.95 21.41,18.29 22.05,18.29 22.34,18.58 U3.24
GP45  (via drill 0.33)
  Top 0.152: v19.74,18.95 20.4,18.29 20.98,18.29 21.29,17.98 22.17,17.98 22.37,18.18 U3.26
  Bottom 0.152: U3.26 22.37,18.18 22.17,17.98 21.29,17.98 20.98,18.29 20.4,18.29 v19.74,18.95
GP46  (via drill 0.33)
  Top 0.152: U3.28 22.4,17.78 22.3,17.68 21.16,17.68 20.85,17.98 19.86,17.98 v19.81,17.93
  Top 0.254: SJ11.2 17.58,30.93 18.03,30.48 v18.03,29.72
  Bottom 0.152: 19.86,17.98 20.85,17.98 21.16,17.68 22.3,17.68 22.4,17.78 U3.28
  Bottom 0.203: 19.86,17.98 v19.81,17.93 19.76,17.98 19.36,17.98 18.03,19.3 10.67,19.3 9.65,18.29 8.64,18.29 8.13,18.8 6.35,18.8 5.59,19.56 5.59,23.37 7.87,25.65 15.49,25.65 18.03,28.19 v18.03,29.72
GP47  (via drill 0.33)
  Top 0.152: v20.6,17.3 20.68,17.37 22.43,17.37 22.43,17.38 U3.30
  Top 0.203: U3.30 24.18,17.38 24.61,16.94 24.61,7.85 22.1,5.33 v20.32,5.33
  Top 0.254: SJ12.2 14.03,30.93 v14.22,30.73
  Bottom 0.152: v20.6,17.3 20.68,17.37 22.43,17.37 22.43,17.38 U3.30
  Bottom 0.203: v20.32,5.33 12.7,5.33 10.92,7.11 10.92,15.24 10.41,15.75 5.08,15.75 4.06,16.76 4.06,24.38 3.81,24.64 3.81,28.96 5.84,30.99 13.97,30.99 v14.22,30.73
GP48  (via drill 0.33)
  Top 0.152: U3.32 21.68,16.98 v21.41,16.71
  Top 0.203: U3.32 23.99,16.98 24.21,16.76 24.21,8.2 22.61,6.6 v20.32,6.6
  Top 0.254: SJ13.2 9.71,30.93 v10.41,30.23
  Bottom 0.152: U3.32 21.68,16.98 v21.41,16.71
  Bottom 0.203: v20.32,6.6 19.56,5.84 12.95,5.84 11.43,7.37 11.43,15.49 10.67,16.26 5.33,16.26 4.57,17.02 4.57,24.64 4.32,24.89 4.32,28.7 6.1,30.48 9.4,30.48 9.65,30.23 v10.41,30.23
GP49  (via drill 0.33)
  Top 0.152: v19.66,16.92 19.94,16.64 20.55,16.64 21.13,16.05 21.68,16.05 22.2,16.58 U3.34
  Top 0.203: SJ14.2 6.15,30.93 6.6,30.48 v6.6,29.72
  Bottom 0.152: v19.66,16.92 19.94,16.64 20.55,16.64 21.13,16.05 21.69,16.05 22.22,16.58 U3.34
  Bottom 0.203: v6.6,29.72 6.6,25.15 5.08,23.62 5.08,19.3 6.1,18.29 7.87,18.29 8.38,17.78 9.91,17.78 10.92,18.8 17.78,18.8 v19.66,16.92
GP77_SD_0_CD#  (via drill 0.33)
  Top 0.152: U3.60 22.12,11.38 21.59,10.85 21.29,10.85 v20.95,10.52
  Bottom 0.152: v20.95,10.52 21.29,10.85 21.59,10.85 22.12,11.38 U3.60
GP78_SD_0_CLK  (via drill 0.33)
  Top 0.152: U3.58 22.09,11.78 21.49,11.18 20.17,11.18 v20.14,11.15
  Bottom 0.152: v20.14,11.15 20.17,11.18 21.49,11.18 22.09,11.78 U3.58
GP79_SD_0_CMD  (via drill 0.33)
  Top 0.152: U3.62 22.16,10.98 21.64,10.46 21.64,10.26 21.23,9.86 20.3,9.86 v19.99,10.16
  Bottom 0.152: v19.99,10.16 20.3,9.86 21.23,9.86 21.64,10.26 21.64,10.46 22.16,10.98 U3.62
GP80_SD_0_DAT0  (via drill 0.33)
  Top 0.152: v21.31,8.89 21.31,9.04 22.45,10.18 U3.66
  Bottom 0.152: U3.66 22.45,10.18 21.31,9.04 v21.31,8.89
GP81_SD_0_DAT1  (via drill 0.33)
  Top 0.152: U3.70 22.56,9.38 22.38,9.2 22.38,8.79 22.99,8.18 v23.04,8.18
  Bottom 0.152: v23.04,8.18 22.99,8.18 22.38,8.79 22.38,9.2 22.56,9.38 U3.70
GP82_SD_0_DAT2  (via drill 0.33)
  Top 0.152: U3.64 22.19,10.58 21.95,10.34 21.95,10.11 21.39,9.55 20.7,9.55 v20.34,9.2
  Bottom 0.152: v20.34,9.2 20.7,9.55 21.39,9.55 21.95,10.11 21.95,10.34 22.19,10.58 U3.64
GP83_SD_0_DAT3  (via drill 0.33)
  Top 0.152: v22,8.15 22,9.25 22.53,9.78 U3.68
  Bottom 0.152: U3.68 22.53,9.78 22,9.25 v22,8.15
GP84_SD_CLK_FB  (via drill 0.33)
  Top 0.152: U3.44 22.48,14.58 22.4,14.5 21.89,14.5 21.31,15.09 v21.16,15.09
  Bottom 0.152: v21.16,15.09 21.31,15.09 21.89,14.5 22.4,14.5 22.48,14.58 U3.44 | U3.44
GP109_SPI_2_CLK  (via drill 0.33)
  Top 0.152: U3.55 26.99,12.18 27.33,11.84 28.14,11.84 28.75,12.45 28.98,12.45 29.64,13.11 v29.64,13.44
  Top 0.203: SJ9.1 v2.54,23.37
  Bottom 0.152: v29.64,13.44 29.64,13.11 28.98,12.45 28.75,12.45 28.14,11.84 27.33,11.84 26.99,12.18 U3.55
  Bottom 0.203: U3.55 25.29,12.18 25.07,11.96 25.07,8.59 27.18,6.48 27.18,4.57 26.16,3.56 7.11,3.56 3.56,7.11 3.56,20.57 2.41,21.72 2.41,22.61 2.54,22.73 v2.54,23.37
GP110_SPI_2_FS0  (via drill 0.33)
  Top 0.152: v28.7,13.11 28.7,12.83 28.02,12.14 27.46,12.14 27.02,12.58 U3.53
  Top 0.254: SJ4.2 5.08,7.62 5.59,7.11 v6.35,7.11
  Bottom 0.152: U3.53 27.02,12.58 27.46,12.14 28.02,12.14 28.7,12.83 v28.7,13.11
  Bottom 0.203: U3.53 25.08,12.58 24.66,12.17 24.66,7.9 20.83,4.06 7.37,4.06 6.35,5.08 v6.35,7.11
GP111_SPI_2_FS1  (via drill 0.33)
  Top 0.152: v27.74,12.8 27.56,12.98 U3.51
  Top 0.254: SJ5.2 8.89,7.87 v10.41,6.35
  Bottom 0.152: U3.51 27.56,12.98 v27.74,12.8
  Bottom 0.203: U3.51 24.87,12.98 24.26,12.37 24.26,8.26 20.57,4.57 12.7,4.57 10.92,6.35 v10.41,6.35
GP114_SPI_2_RXD  (via drill 0.33)
  Top 0.152: U3.59 26.92,11.38 27.08,11.23 28.91,11.23 v29.03,11.35
  Top 0.203: 27.43,6.22 25.02,8.64 25.02,11.18 25.22,11.38 U3.59
  Top 0.254: SJ7.2 16.51,7.87 v17.02,7.37 20.07,4.32 22.1,4.32 22.73,3.68 26.54,3.68 27.43,4.57 27.43,6.22 | SJ6.2 v12.7,7.37
  Bottom 0.152: U3.59 26.92,11.38 27.08,11.23 28.91,11.23 v29.03,11.35
  Bottom 0.203: v12.7,7.37 v17.02,7.37
GP115_SPI_2_TXD  (via drill 0.33)
  Top 0.152: U3.57 26.95,11.78 27.2,11.53 28.27,11.53 28.88,12.14 29.62,12.14 v29.64,12.17
  Top 0.254: SJ8.1 2.54,18.03 v2.03,17.53
  Bottom 0.152: U3.57 26.95,11.78 27.2,11.53 28.27,11.53 28.88,12.14 29.59,12.14 29.62,12.17 v29.64,12.17 29.62,12.14
  Bottom 0.203: 29.62,12.14 29.62,11.91 29.84,11.68 29.84,6.48 26.42,3.05 6.86,3.05 2.03,7.87 v2.03,17.53
GP128_UART_1_CTS  (via drill 0.33)
  Top 0.152: U3.65 26.9,10.18 27.84,9.25 v27.91,9.25
  Bottom 0.152: v27.91,9.25 27.84,9.25 26.9,10.18 U3.65
GP129_UART_1_RTS  (via drill 0.33)
  Top 0.152: v28.93,10.34 28.5,9.91 27.66,9.91 26.99,10.58 U3.63
  Bottom 0.152: U3.63 26.99,10.58 27.66,9.91 28.5,9.91 v28.93,10.34
GP130_UART_1_RX  (via drill 0.33)
  Top 0.152: v27.94,10.57 27.61,10.9 26.95,10.9 26.87,10.98 U3.61
  Bottom 0.152: U3.61 26.87,10.98 26.95,10.9 27.61,10.9 v27.94,10.57
GP131_UART_1_TX  (via drill 0.33)
  Top 0.152: U3.46 22.52,14.18 22.5,14.2 21.77,14.2 21.54,14.43 20.85,14.43 20.3,14.99 v20.07,14.99
  Bottom 0.152: v20.07,14.99 20.3,14.99 20.85,14.43 21.54,14.43 21.77,14.2 22.5,14.2 22.52,14.18 U3.46
GP134_UART_2_RX  (via drill 0.33)
  Top 0.152: v21.77,18.95 21.8,18.98 U3.22
  Bottom 0.152: U3.22 21.8,18.98 v21.77,18.95
GP135_UART_2_TX  (via drill 0.33)
  Top 0.152: v29.39,18.54 29.06,18.54 28.73,18.21 28.35,18.21 27.76,17.63 27.23,17.63 27.08,17.78 U3.27
  Bottom 0.152: U3.27 27.08,17.78 27.23,17.63 27.76,17.63 28.35,18.21 28.73,18.21 29.06,18.54 v29.39,18.54
GP165  (via drill 0.33)
  Top 0.152: v27.48,18.29 27.38,18.18 U3.25
  Top 0.203: U3.25 25.18,18.18 24.61,18.75 24.61,23.65 23.88,24.38 21.84,24.38 21.59,24.64 21.59,30.48 21.14,30.93 SJ10.2
  Bottom 0.152: U3.25 27.38,18.18 v27.48,18.29
GP182_PWM2  (via drill 0.33)
  Top 0.152: U3.37 27.02,15.78 27.1,15.7 27.61,15.7 28.14,16.23 v28.32,16.23
  Bottom 0.152: v28.32,16.23 28.14,16.23 27.61,15.7 27.1,15.7 27.02,15.78 U3.37
GP183_PWM3  (via drill 0.33)
  Top 0.152: v29.39,16.41 29.39,16.36 28.6,15.57 27.91,15.57 27.74,15.39 26.62,15.39 26.61,15.38 U3.39
  Bottom 0.152: U3.39 26.61,15.38 26.62,15.39 27.74,15.39 27.91,15.57 28.6,15.57 29.39,16.36 v29.39,16.41
INT1_XM
  Top 0.254: U1.13 14.24,24.11 8.89,29.46 SJ13.1
INT2_XM
  Top 0.254: U1.14 13.98,23.61 8.89,28.7 5.59,28.7 5.08,29.21 SJ14.1
INT_G
  Top 0.254: U1.11 15.76,25.64 15.49,25.91 13.97,25.91 12.95,26.92 12.95,28.96 13.46,29.46 14.99,29.46 15.55,30.03 SJ11.1
MSIC_SLP_CLK  (via drill 0.33)
  Top 0.152: v27.51,21.46 27.19,21.78 U3.7
  Bottom 0.152: U3.7 27.19,21.78 v27.51,21.46
N$1
  Top 0.254: C5.1 14.39,27.27 14.73,26.92 16,26.92 16.76,26.17 U1.9
N$2
  Top 0.254: U1.8 17.26,27.7 17.02,27.94 C5.2
N$3
  Top 0.254: C6.1 18.2,26.84 17.76,26.4 U1.7
N$4
  Top 0.254: R3.2 8.89,11.43 7.62,10.16 7.62,6.35 8.89,5.08 8.89,4.57 8.38,4.06 8.38,2.03 8.69,1.73 SJ2.1
N$5
  Top 0.254: R4.2 11.43,6.1 9.53,4.19 SJ2.3
N$6
  Top 0.254: R1.2 6.35,12.95 3.56,10.16 3.56,8.13 5.71,5.97 SJ1.3
N$7
  Top 0.254: R2.2 3.81,11.18 3.05,10.41 3.05,7.87 4.57,6.35 4.57,2.03 4.88,1.73 SJ1.1
N$12
  Top 0.254: R5.2 16.51,13.46 14.48,11.43 14.48,6.6 17.14,3.94 SJ3.1
N$13
  Top 0.254: R6.2 13.97,6.6 13.34,5.97 SJ15.1
OSC_CLK_OUT  (via drill 0.33)
  Top 0.152: v27.51,8.33 27.23,8.61 27.23,9.37 26.82,9.78 U3.67
  Bottom 0.152: U3.67 26.82,9.78 27.23,9.37 27.23,8.61 v27.51,8.33
PSW  (via drill 0.33)
  Top 0.152: v29.21,19.53 29.18,19.56 28.17,19.56 27.86,19.25 27.05,19.25 26.78,18.98 U3.21
  Bottom 0.152: U3.21 26.78,18.98 27.05,19.25 27.86,19.25 28.17,19.56 29.18,19.56 v29.21,19.53
PWRBTN#  (via drill 0.33)
  Top 0.152: v28.19,20.52 27.53,19.86 26.8,19.86 26.71,19.78 U3.17
  Bottom 0.152: U3.17 26.71,19.78 26.8,19.86 27.53,19.86 v28.19,20.52
RCVR_MODE  (via drill 0.33)
  Top 0.152: v28.65,17.55 28.12,17.55 27.89,17.32 26.92,17.32 26.58,16.98 U3.31
  Bottom 0.152: U3.31 26.58,16.98 26.92,17.32 27.89,17.32 28.12,17.55 v28.65,17.55
RESET_OUT#  (via drill 0.33)
  Top 0.152: U3.36 22.25,16.18 21.82,15.75 20.5,15.75 v20.27,15.98
  Bottom 0.152: v20.27,15.98 20.5,15.75 21.82,15.75 22.25,16.18 U3.36
SCL  (via drill 0.33)
  Top 0.254: SJ9.2 1.52,25.4 1.27,25.15 1.27,16.51 1.69,16.09 R2.1 3.81,17.02 4.06,17.27 v5.59,17.27 | U1.21 16.26,19.82 14.48,18.03 12.57,18.03 v12.06,17.53
  Bottom 0.203: v5.59,17.27 6.1,16.76 10.67,16.76 11.43,17.53 v12.06,17.53
SDA  (via drill 0.33)
  Top 0.254: R1.1 6.35,17.53 | SJ8.2 3.81,20.32 4.57,19.56 4.57,18.8 5.33,18.03 6.1,18.03 6.35,17.78 6.35,17.53 | U1.24 17.76,18.52 v16.76,17.53 | v7.11,17.53 6.35,17.53
  Bottom 0.203: v16.76,17.53 14.73,17.53 13.97,18.29 11.43,18.29 10.41,17.27 8.13,17.27 7.87,17.53 v7.11,17.53
SDO_G  (via drill 0.33)
  Top 0.254: v15.75,11.18 14.99,10.41 14.99,7.11 19.11,2.99 SJ17.2 | U1.22 16.76,19.55 14.48,17.27 v13.21,17.27 12.7,16.76 12.7,16.1 | 12.7,16.1 SJ6.1 | R6.1 12.71,16.09 12.7,16.1
  Bottom 0.203: v15.75,11.18 15.75,15.75 14.22,17.27 v13.21,17.27
SDO_XM
  Top 0.254: U1.23 17.26,19.29 15.24,17.27 15.24,16.26 15.41,16.09 R5.1 17.18,16.09 17.53,15.75 17.53,12.95 16.51,11.94 SJ7.1 15.69,9.34 15.49,9.14 15.49,7.37 19.05,3.81 21.84,3.81 22.66,2.99 SJ16.2
USB_DN  (via drill 0.33)
  Top 0.152: U3.18 22.64,19.78 22.5,19.91 20.12,19.91 19.48,20.55 v19.48,21.01
  Bottom 0.152: v19.48,21.01 19.48,20.55 20.12,19.91 22.5,19.91 22.64,19.78 U3.18
USB_DP  (via drill 0.33)
  Top 0.152: v20.4,20.57 20.73,20.24 22.63,20.24 22.7,20.18 U3.16
  Bottom 0.152: U3.16 22.7,20.18 22.63,20.24 20.73,20.24 v20.4,20.57
USB_ID  (via drill 0.33)
  Top 0.152: v27.51,22.86 27.23,22.58 U3.3
  Bottom 0.152: U3.3 27.23,22.58 v27.51,22.86
USB_VBUS  (via drill 0.33)
  Top 0.152: v19.1,19.99 19.48,19.61 22.28,19.61 22.5,19.38 U3.20
  Bottom 0.152: U3.20 22.5,19.38 22.28,19.61 19.48,19.61 v19.1,19.99
V_BAT_BKUP  (via drill 0.33)
  Top 0.152: v28.45,18.87 28.37,18.95 27.18,18.95 26.81,18.58 U3.23
  Bottom 0.152: U3.23 26.81,18.58 27.18,18.95 28.37,18.95 v28.45,18.87
VSYS  (via drill 0.33)
  Top 0.152: U3.2 22.48,22.98 | 22.48,22.98 22.05,22.98 v21.59,23.44 | U3.6 22.52,22.18 22.48,22.23 22.48,22.61 | 22.48,22.61 22.48,22.98 | U3.4 22.5,22.58 22.48,22.61
  Top 0.254: U4.3 10.47,19.36 9.4,18.29 7.87,18.29 7.62,18.54 | 7.62,18.54 6.6,18.54 6.35,18.8 C1.1 | 7.62,18.54 8.57,19.5 U4.1
  Top 0.381: C1.1 7.28,19.47 7.62,19.81 v7.62,20.32 v7.62,21.34
  Top 0.508: C1.1 6.35,19.3
  Bottom 0.152: U3.2 22.48,22.98 | 22.48,22.98 22.05,22.98 v21.59,23.44 | U3.6 22.52,22.18 22.48,22.23 22.48,22.61 | 22.48,22.61 22.48,22.98 | U3.4 22.5,22.58 22.48,22.61
  Bottom 0.381: v7.62,21.34 v7.62,20.32 12.45,20.32 14.99,22.86 21.01,22.86 v21.59,23.44

### Text on the board
Top: v10
tPlace: Y | Z | X | INT2 | INT1 | DRDYG | INTG | DEN | SCL | CLOCK | 9DOF Block | SCK | SDA | DATA | MOSI | CSG | CSXM | SDOG | SDOXM | I2C / PUs | CS / PUs | SDOG | SDOXM | SDOG | SDOXM | PU | PU | PD | PD
bPlace: 9DOF Block | 4xM2.0
tDocu: NOTE: Units are in Inches | Shawn Hymel